# EAGLE design MAIN (EAGLE 7.6.0)
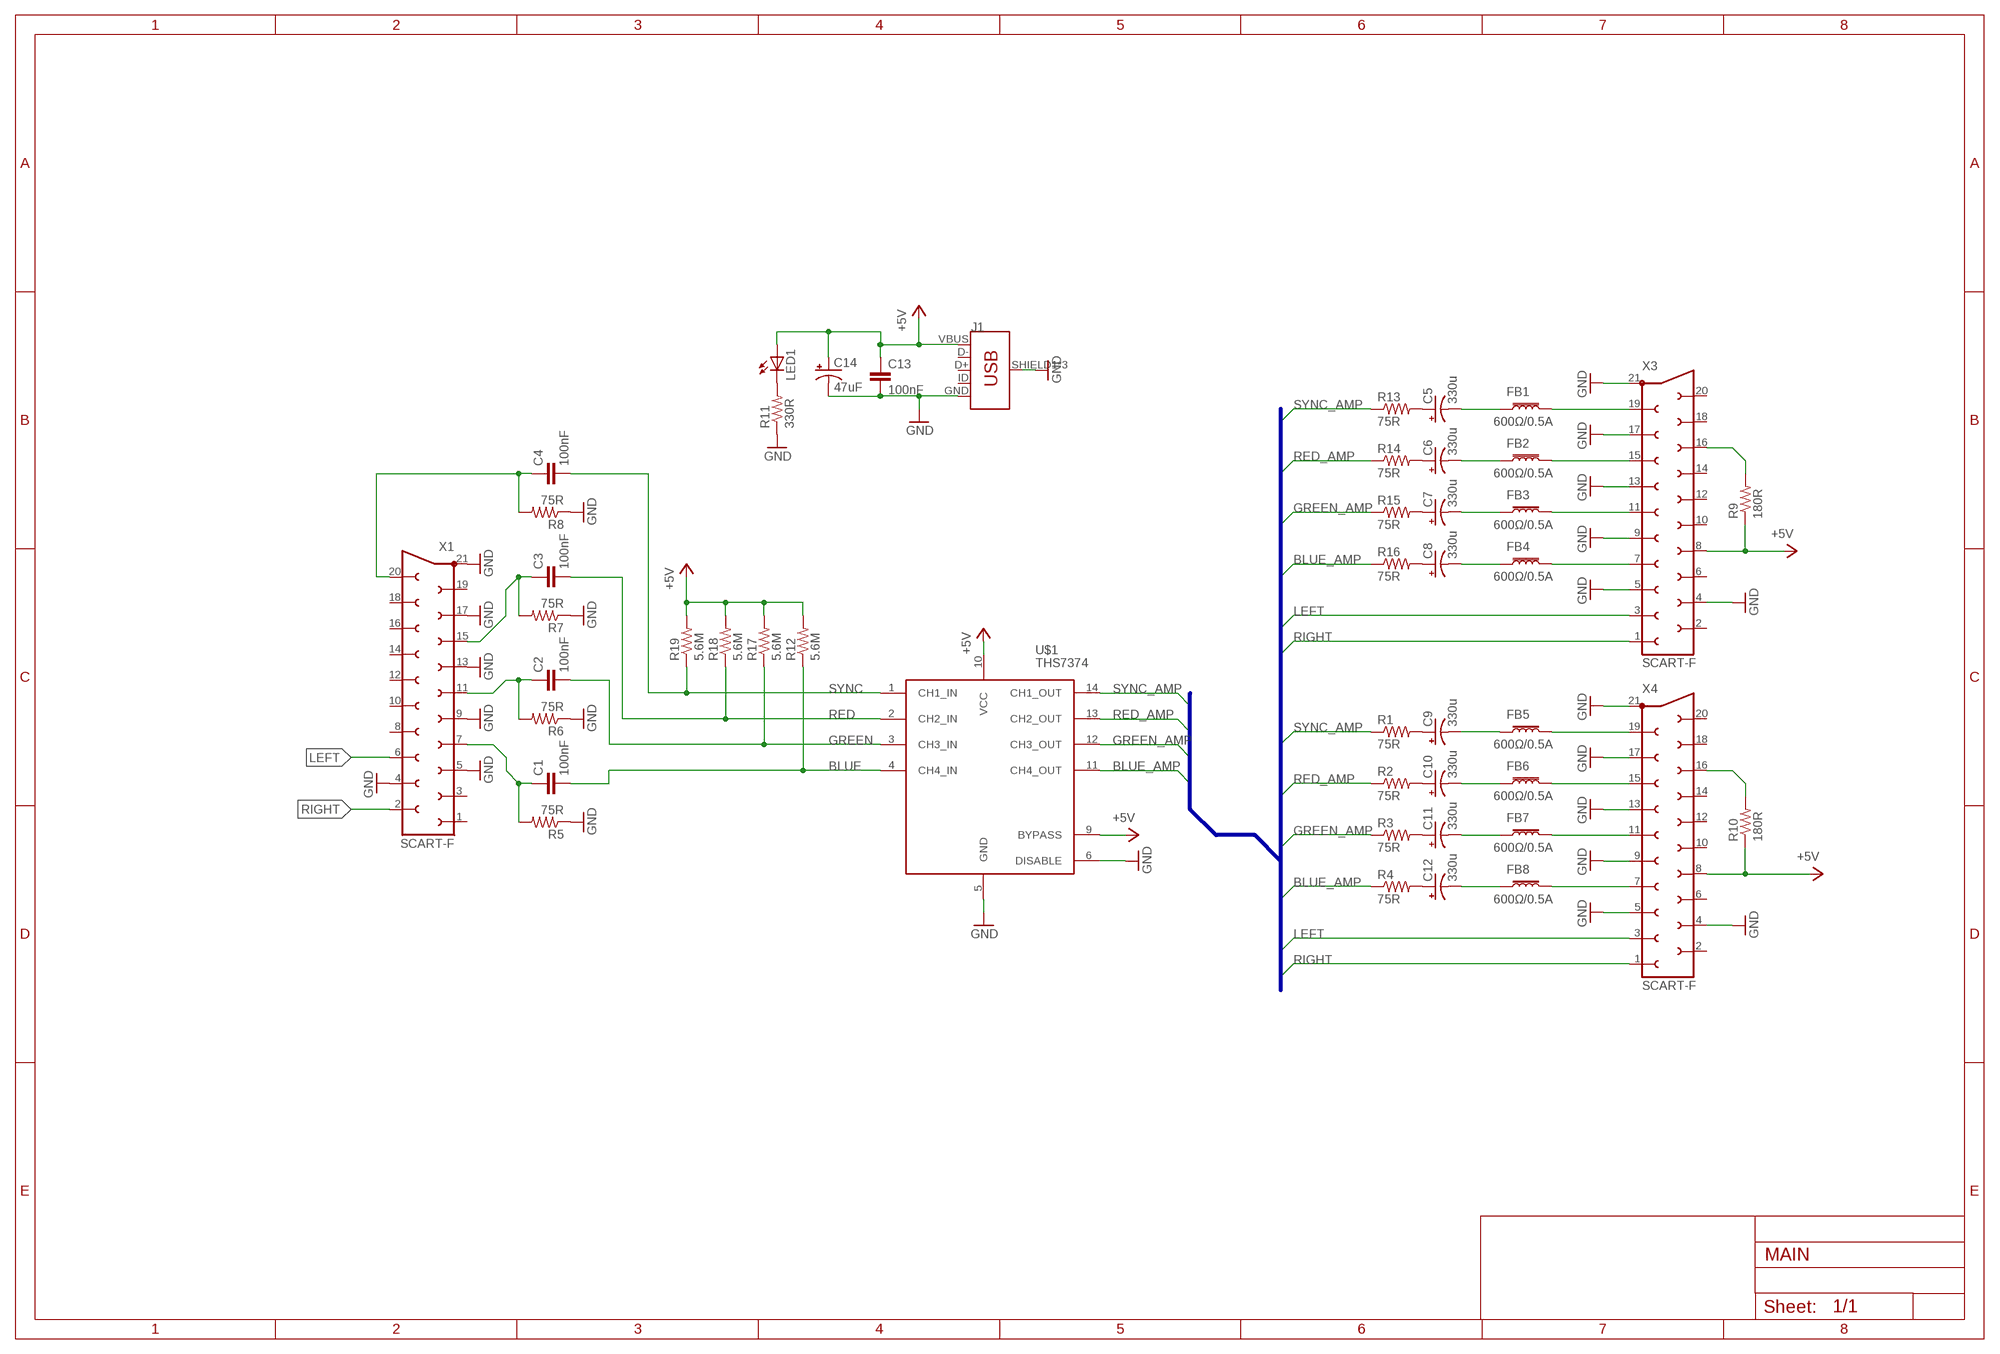
[diagram p0: schematic, sheet 1]

## Parts
C1  100nF  C-EU050-025X075  [C050-025X075]
C2  100nF  C-EU050-025X075  [C050-025X075]
C3  100nF  C-EU050-025X075  [C050-025X075]
C4  100nF  C-EU050-025X075  [C050-025X075]
C5  330u  CPOL-USE3.5-8  [E3,5-8]
C6  330u  CPOL-USE3.5-8  [E3,5-8]
C7  330u  CPOL-USE3.5-8  [E3,5-8]
C8  330u  CPOL-USE3.5-8  [E3,5-8]
C9  330u  CPOL-USE3.5-8  [E3,5-8]
C10  330u  CPOL-USE3.5-8  [E3,5-8]
C11  330u  CPOL-USE3.5-8  [E3,5-8]
C12  330u  CPOL-USE3.5-8  [E3,5-8]
C13  100nF  C-EU050-025X075  [C050-025X075]
C14  47uF  CPOL-USE3.5-8  [E3,5-8]
FB1  600Ω/0.5A  FERRITE_BEAD-0603  [0603]
FB2  600Ω/0.5A  FERRITE_BEAD-0603  [0603]
FB3  600Ω/0.5A  FERRITE_BEAD-0603  [0603]
FB4  600Ω/0.5A  FERRITE_BEAD-0603  [0603]
FB5  600Ω/0.5A  FERRITE_BEAD-0603  [0603]
FB6  600Ω/0.5A  FERRITE_BEAD-0603  [0603]
FB7  600Ω/0.5A  FERRITE_BEAD-0603  [0603]
FB8  600Ω/0.5A  FERRITE_BEAD-0603  [0603]
J1  USB_MICRO-B_FEMALE-SMT  [USB-B-MICRO-SMD]
LED1  LED5MM  [LED5MM]
R1  75R  R-US_0204/7  [0204/7]
R2  75R  R-US_0204/7  [0204/7]
R3  75R  R-US_0204/7  [0204/7]
R4  75R  R-US_0204/7  [0204/7]
R5  75R  R-US_0204/7  [0204/7]
R6  75R  R-US_0204/7  [0204/7]
R7  75R  R-US_0204/7  [0204/7]
R8  75R  R-US_0204/7  [0204/7]
R9  180R  R-US_0204/7  [0204/7]
R10  180R  R-US_0204/7  [0204/7]
R11  330R  R-US_0204/7  [0204/7]
R12  5.6M  R-US_0204/7  [0204/7]
R13  75R  R-US_0204/7  [0204/7]
R14  75R  R-US_0204/7  [0204/7]
R15  75R  R-US_0204/7  [0204/7]
R16  75R  R-US_0204/7  [0204/7]
R17  5.6M  R-US_0204/7  [0204/7]
R18  5.6M  R-US_0204/7  [0204/7]
R19  5.6M  R-US_0204/7  [0204/7]
U$1  THS7374  [TSSOP-14]
X1  SCART-F  [SCART-F]
X3  SCART-F  [SCART-F]
X4  SCART-F  [SCART-F]

## Nets
+5V: C13.1 C14.+ J1.VBUS LED1.A R9.1 R10.1 R12.2 R17.2 R18.2 R19.2 U$1.9(BYPASS) U$1.10(VCC) X3.8 X4.8
BLUE: C1.2 R12.1 U$1.4(CH4_IN)
BLUE_AMP: R4.1 R16.1 U$1.11(CH4_OUT)
GND: C13.2 C14.- J1.GND J1.SHIELD1(SHIELD) J1.SHIELD2(SHIELD) J1.SHIELD3(SHIELD) R5.1 R6.1 R7.1 R8.1 R11.1 U$1.5(GND) U$1.6(DISABLE) X1.4 X1.5 X1.9 X1.13 X1.17 X1.21 X3.4 X3.5 X3.9 X3.13 X3.17 X3.21 X4.4 X4.5 X4.9 X4.13 X4.17 X4.21
GREEN: C2.2 R17.1 U$1.3(CH3_IN)
GREEN_AMP: R3.1 R15.1 U$1.12(CH3_OUT)
LEFT: X1.6 X3.3 X4.3
N$1: C9.+ R1.2
N$2: C10.+ R2.2
N$3: C11.+ R3.2
N$4: C12.+ R4.2
N$5: C5.+ R13.2
N$6: C6.+ R14.2
N$7: C7.+ R15.2
N$8: C8.+ R16.2
N$9: R10.2 X4.16
N$10: C1.1 R5.2 X1.7
N$11: R9.2 X3.16
N$12: C2.1 R6.2 X1.11
N$13: C3.1 R7.2 X1.15
N$16: LED1.K(C) R11.2
N$19: C4.1 R8.2 X1.20
N$21: C5.- FB1.1
N$22: C6.- FB2.1
N$23: C7.- FB3.1
N$24: C8.- FB4.1
N$25: FB1.2 X3.19
N$26: FB2.2 X3.15
N$27: FB3.2 X3.11
N$28: FB4.2 X3.7
N$29: FB8.2 X4.7
N$30: FB7.2 X4.11
N$31: FB6.2 X4.15
N$32: FB5.2 X4.19
N$33: C9.- FB5.1
N$34: C10.- FB6.1
N$35: C11.- FB7.1
N$36: C12.- FB8.1
RED: C3.2 R18.1 U$1.2(CH2_IN)
RED_AMP: R2.1 R14.1 U$1.13(CH2_OUT)
RIGHT: X1.2 X3.1 X4.1
SYNC: C4.2 R19.1 U$1.1(CH1_IN)
SYNC_AMP: R1.1 R13.1 U$1.14(CH1_OUT)
Unconnected: J1.D+ J1.D- J1.ID X1.1 X1.3 X1.8 X1.10 X1.12 X1.14 X1.16 X1.18 X1.19 X3.2 X3.6 X3.10 X3.12 X3.14 X3.18 X3.20 X4.2 X4.6 X4.10 X4.12 X4.14 X4.18 X4.20

## Buses
B$1

## Library data of the parts
C1-C4 C13 = rcl:C-EU: CAPACITOR, European symbol
C5-C12 C14 = rcl:CPOL-US: POLARIZED CAPACITOR, American symbol
FB1-FB8 = SparkFun-Coils:FERRITE_BEAD: Ferrite Bead (blocks, cores, rings, chokes, etc.) Inductor with layers of ferrite used to suppress high frequencies. Often used to isolate high frequency noise. SparkFun Products: IOIO-OTG - V2.2 <https://www.sparkfun.com/products/13613> SparkFun SAMD21 Mini Breakout <https://www.sparkfun.com/products/13664> SparkFun 6 Degrees of Freedom Breakout - LSM6DS3 <https://www.sparkfun.com/products/13339> SparkFun SAMD21 Dev Breakout <https://www.sparkfun.com/products/13672>; PROD_ID: NDUC-13805; VALUE: 30Ω/1.8A
J1 = SparkFun-Connectors:USB_MICRO-B: USB Type Micro-B Connector Male/female and PTH/SMT variants SparkFun Products: SparkFun microB USB Breakout <https://www.sparkfun.com/products/12035> SparkFun USB microB Plug Breakout <https://www.sparkfun.com/products/10031> SparkFun ESP8266 Thing <https://www.sparkfun.com/products/13231>; PROD_ID: CONN-11752
LED1 = led:LED: LED OSRAM: - CHIPLED LG R971, LG N971, LY N971, LG Q971, LY Q971, LO R971, LY R971 LH N974, LH R974 LS Q976, LO Q976, LY Q976 LO Q996 - Hyper CHIPLED LW Q18S LB Q993, LB Q99A, LB R99A - SideLED LS A670, LO A670, LY A670, LG A670, LP A670 LB A673, LV A673, LT A673, LW A673 LH A674 LY A675 LS A676, LA A676, LO A676, LY A676, LW A676 LS A679, LY A679, LG A679 - Hyper Micro SIDELED® LS Y876, LA Y876, LO Y876, LY Y876 LT Y87S - SmartLED LW L88C, LW L88S LB L89C, LB L89S, LG L890 LS L89K, LO L89K, LY L89K LS L896, LA L896, LO L896, LY L896 - TOPLED LS T670, LO T670, LY T670, LG T670, LP T670 LSG T670, LSP T670, LSY T670, LOP T670, LYG T670 LG T671, LOG T671, LSG T671 LB T673, LV T673, LT T673, LW T673 LH T674 LS T676, LA T676, LO T676, LY T676, LB T676, LH T676, LSB T676, LW T676 LB T67C, LV T67C, LT T67C, LS T67K, LO T67K, LY T67K, LW E67C LS E67B, LA E67B, LO E67B, LY E67B, LB E67C, LV E67C, LT E67C LW T67C LS T679, LY T679, LG T679 LS T770, LO T770, LY T770, LG T770, LP T770 LB T773, LV T773, LT T773, LW T773 LH T774 LS E675, LA E675, LY E675, LS T675 LS T776, LA T776, LO T776, LY T776, LB T776 LHGB T686 LT T68C, LB T68C - Hyper Mini TOPLED® LB M676 - Mini TOPLED Santana® LG M470 LS M47K, LO M47K, LY M47K Source: http://www.osram.convergy.de LUXEON: - LUMILED® LXK2-PW12-R00, LXK2-PW12-S00, LXK2-PW14-U00, LXK2-PW14-V00 LXK2-PM12-R00, LXK2-PM12-S00, LXK2-PM14-U00 LXK2-PE12-Q00, LXK2-PE12-R00, LXK2-PE12-S00, LXK2-PE14-T00, LXK2-PE14-U00 LXK2-PB12-K00, LXK2-PB12-L00, LXK2-PB12-M00, LXK2-PB14-N00, LXK2-PB14-P00, LXK2-PB14-Q00 LXK2-PR12-L00, LXK2-PR12-M00, LXK2-PR14-Q00, LXK2-PR14-R00 LXK2-PD12-Q00, LXK2-PD12-R00, LXK2-PD12-S00 LXK2-PH12-R00, LXK2-PH12-S00 LXK2-PL12-P00, LXK2-PL12-Q00, LXK2-PL12-R00 Source: www.luxeon.com KINGBRIGHT: KA-3528ASYC Source: www.kingbright.com
R1-R19 = rcl:R-US_: RESISTOR, American symbol
U$1 = THS7374:THS7374
X1 X3 X4 = con-hirschmann:SCART-F: TV SCART CONNECTOR; OC_FARNELL: unknown; OC_NEWARK: unknown

## Net classes
0 default: width 0.406 mm

## Board
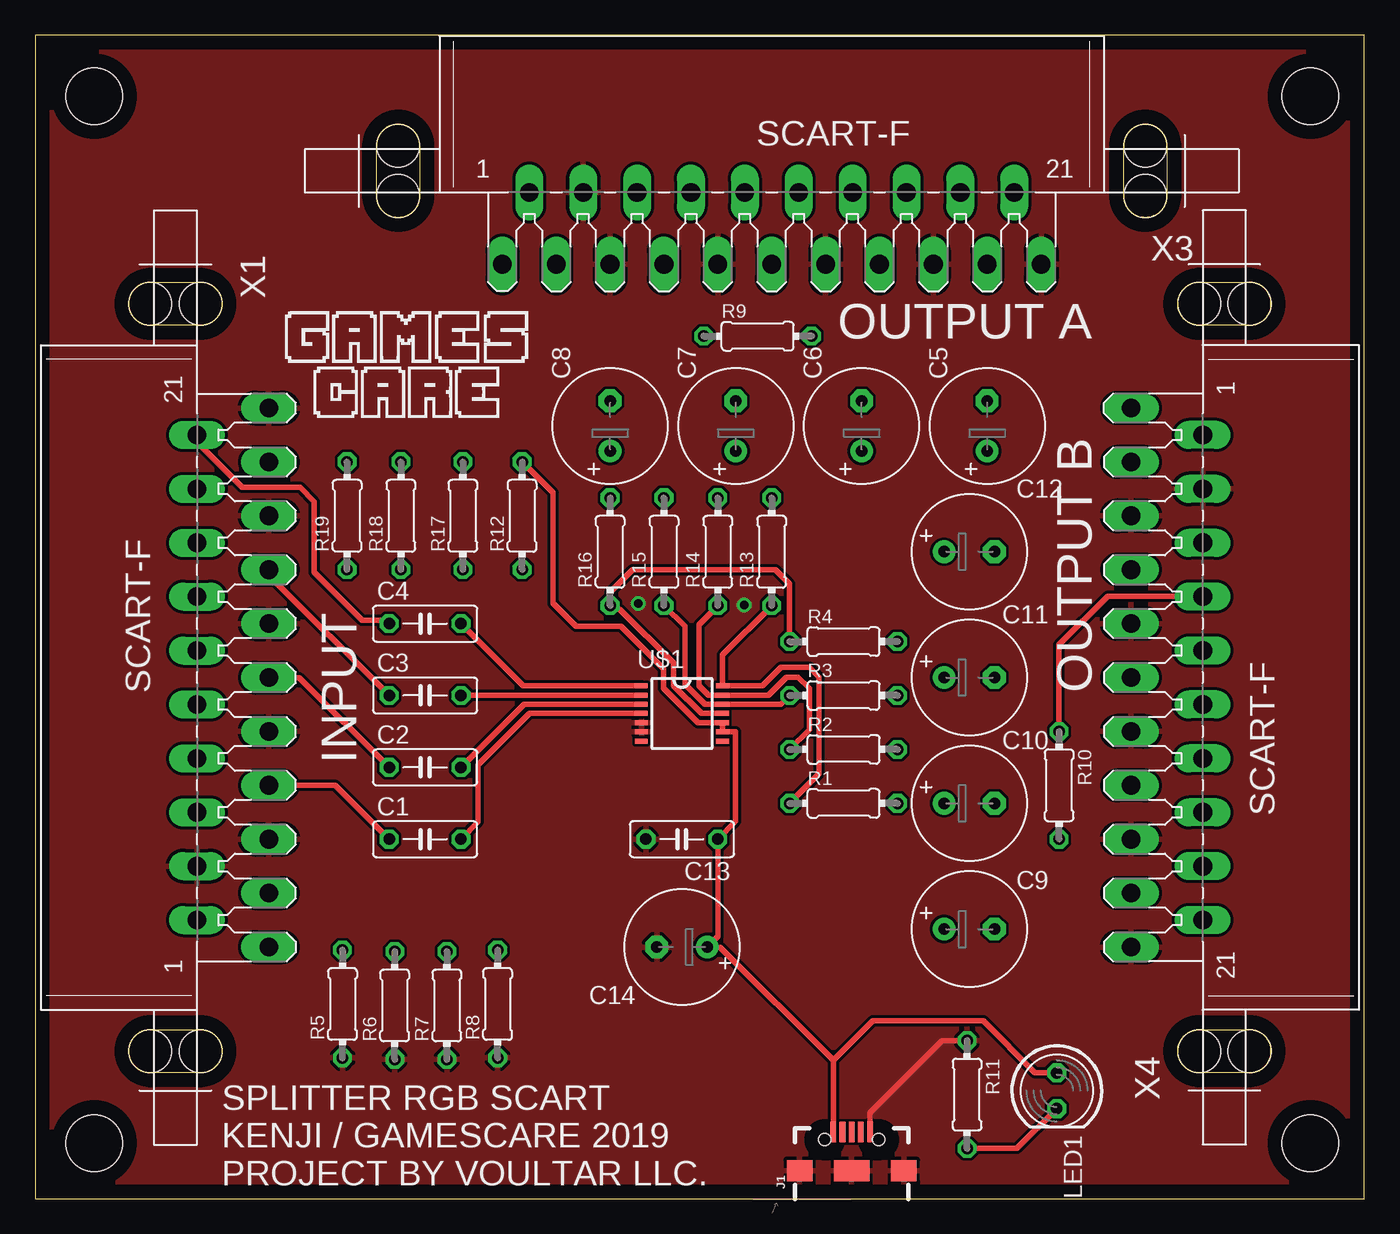
[diagram p1: board, top side]
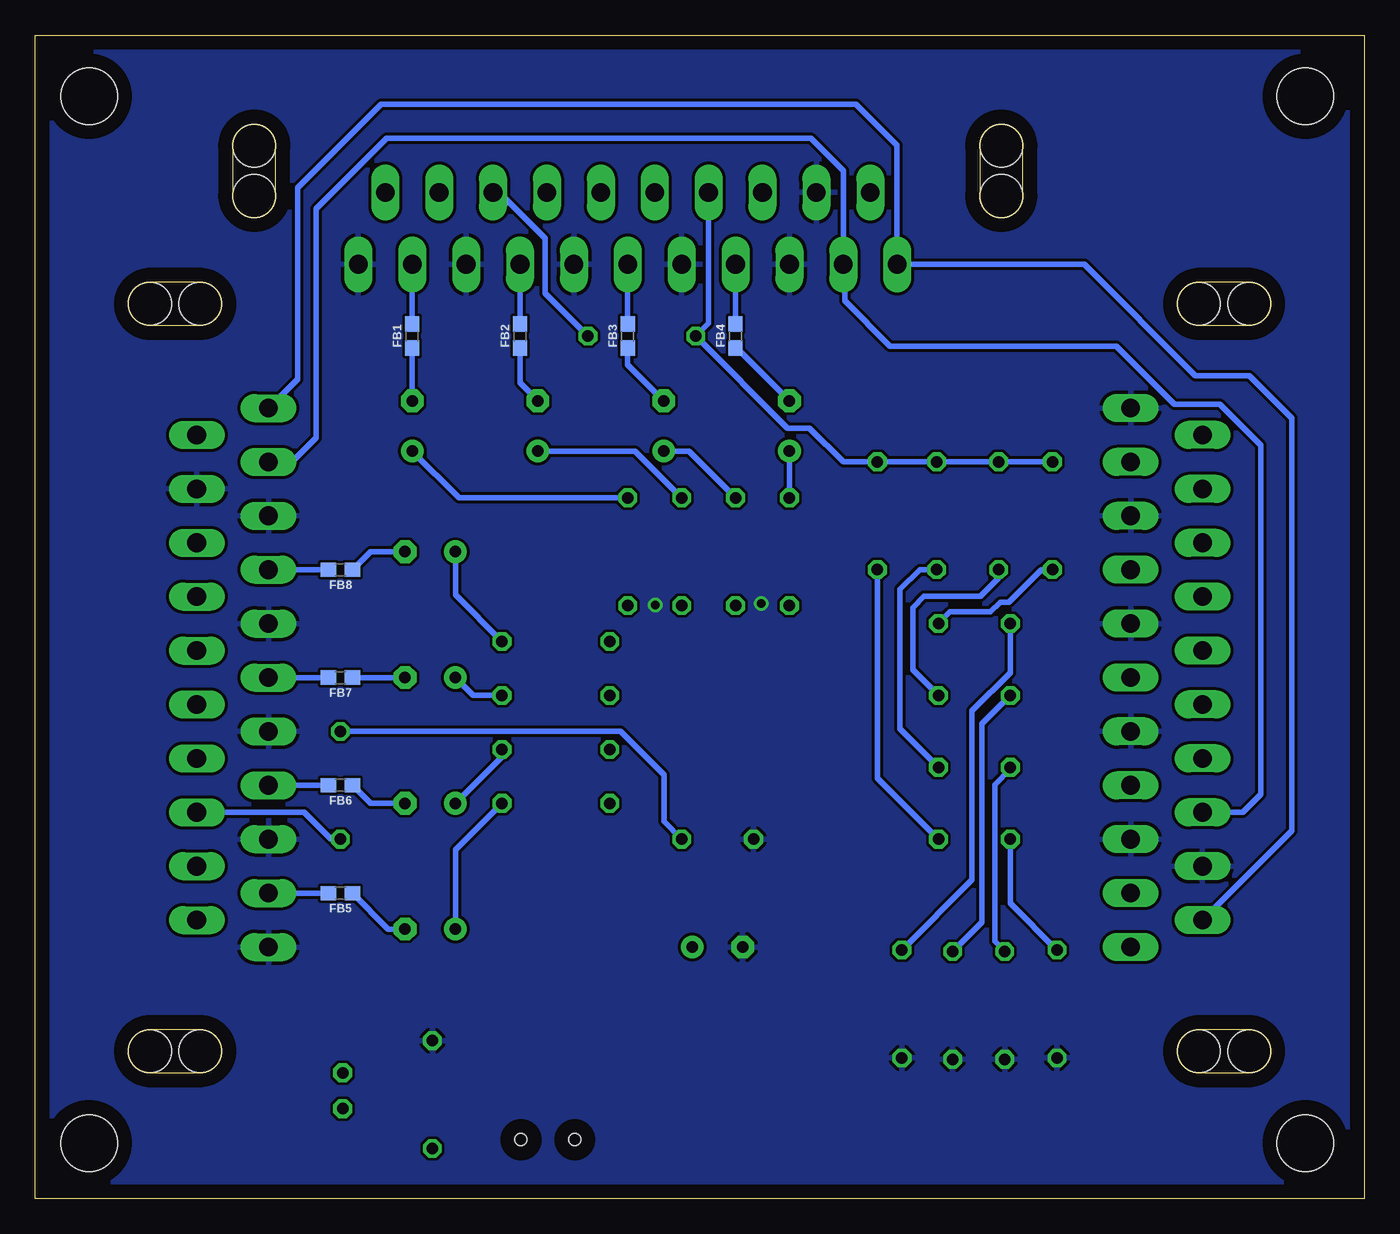
[diagram p2: board, bottom side, seen from below]

Size 93.96 x 82.22 mm. Coordinates in mm from the lower left corner, seen from the top.
Outline: 0,0 93.96,0 93.96,82.22 0,82.22 0,0
Copper layers (1*16): Top 0.035mm / dielectric 1.5mm / Bottom 0.035mm
Design rules "default": minimum track width 10mil, minimum drill 24mil, track to track 8mil, track to pad 8mil, pad to pad 8mil, via to via 8mil, smd to smd 8mil, copper to edge 40mil, drill to drill 8mil, minimum pad ring 10mil, minimum via ring 8mil, stop-mask expansion 4mil, vias tented up to drill 0mil, thermal gap 10mil
Holes 4 mm at 4.16,77.92 90.16,77.92 90.16,3.92 4.16,3.92

### Footprints (pad centres in the part's own frame; a part is rotated, then mirrored left to right if it is on the bottom)
C050-025X075 = drill 0.813 octagon: 1 -2.54,0; 2 2.54,0
E3,5-8 = drill 0.813 pad 1.6: + -1.778,0 | drill 0.813 pad 1.6 octagon: - 1.778,0
0603 = smd 1.1 x 1: 1 -0.85,0; 2 0.85,0
USB-B-MICRO-SMD = smd 1.45 x 0.4: D+ 2.725,0; D- 2.725,0.65; GND 2.725,-1.3; ID 2.725,-0.65; VBUS 2.725,1.3 | smd 1.5 x 1.8: SHIELD1 0,3.685; SHIELD2 0,-3.685 | smd 1.5 x 2.5: SHIELD3 0,0 | hole 0.85: 2.2,1.9; 2.2,-1.9
LED5MM = drill 0.813 octagon: A -1.27,0; K 1.27,0
0204/7 = drill 0.813 octagon: 1 -3.81,0; 2 3.81,0
TSSOP-14 = smd 0.9 x 0.35: 1 -2.875,1.95; 2 -2.875,1.3; 3 -2.875,0.65; 4 -2.875,0; 5 -2.875,-0.65; 6 -2.875,-1.3; 7 -2.875,-1.95; 8 2.875,-1.95; 9 2.875,-1.3; 10 2.875,-0.65; 11 2.875,0; 12 2.875,0.65; 13 2.875,1.3; 14 2.875,1.95
SCART-F = drill 1.321 long: 1 19.05,5.08; 2 17.145,0; 3 15.24,5.08; 4 13.335,0; 5 11.43,5.08; 6 9.525,0; 7 7.62,5.08; 8 5.715,0; 9 3.81,5.08; 10 1.905,0; 11 0,5.08; 12 -1.905,0; 13 -3.81,5.08; 14 -5.715,0; 15 -7.62,5.08; 16 -9.525,0; 17 -11.43,5.08; 18 -13.335,0; 19 -15.24,5.08; 20 -17.145,0; 21 -19.05,5.08 | hole 3.023: 26.416,0.254; 26.416,-3.302; -26.416,0.254; -26.416,-3.302

### Placement (x,y rotation side)
C1  27.56,25.4 0 top
C2  27.56,30.48 0 top
C3  27.56,35.56 0 top
C4  27.56,40.64 0 top
C5  67.31,54.61 90 top
C6  58.42,54.61 90 top
C7  49.53,54.61 90 top
C8  40.64,54.61 90 top
C9  66.04,19.05 0 top
C10  66.04,27.94 0 top
C11  66.04,36.83 0 top
C12  66.04,45.72 0 top
C13  45.72,25.4 180 top
C14  45.72,17.78 180 top
FB1  67.31,60.96 90 bottom
FB2  59.69,60.96 90 bottom
FB3  52.07,60.96 90 bottom
FB4  44.45,60.96 90 bottom
FB5  72.39,21.59 180 bottom
FB6  72.39,29.21 180 bottom
FB7  72.39,36.83 180 bottom
FB8  72.39,44.45 180 bottom
J1  57.72,1.96 90 top
LED1  72.23,7.62 270 top
R1  57.15,27.94 0 top
R2  57.15,31.75 0 top
R3  57.15,35.56 0 top
R4  57.15,39.37 0 top
R5  21.72,13.75 90 top
R6  25.41,13.65 90 top
R7  29.1,13.65 90 top
R8  32.69,13.75 90 top
R9  51.07,60.96 0 top
R10  72.39,29.21 270 top
R11  65.88,7.35 270 top
R12  34.42,48.27 90 top
R13  52.07,45.72 90 top
R14  48.26,45.72 90 top
R15  44.45,45.72 90 top
R16  40.64,45.72 90 top
R17  30.23,48.27 90 top
R18  25.85,48.27 90 top
R19  22.04,48.27 90 top
U$1  45.72,34.29 0 top
X1  11.43,36.83 270 top
X3  52.07,71.12 180 top
X4  82.55,36.83 90 top

### Tracks (layer width: path | path; a pad name or v marks a point on that pad's centre or on a via)
+5V
  Top 0.406: 56.42,9.76 48.4,17.78 C14.+ 48.26,18.54 C13.1 49.52,26.66 49.52,32.99 U$1.9 U$1.10 46.84,33.64 44.42,36.06 44.42,37.46 41.42,40.46 38.22,40.46 36.62,42.06 36.62,49.88 R12.2 | LED1.A 70.69,8.89 67.02,12.56 59.22,12.56 56.42,9.76 | R10.1 72.39,39.13 75.82,42.56 82.53,42.56 X4.8 | 56.42,9.76 J1.VBUS
  Bottom 0.406: X3.8 46.35,61.86 R9.1 40.76,54.46 39.22,54.46 36.83,52.07 R12.2 R17.2 R18.2 R19.2 | R10.1 52.58,33.02 49.52,29.96 49.52,26.66 C13.1
BLUE
  Top 0.406: U$1.4 34.95,34.29 31.32,30.66 31.32,26.62 C1.2
  Bottom 0.406: R12.1 34.42,29.72 C1.2
BLUE_AMP
  Top 0.406: U$1.11 47.09,34.29 45.12,36.26 45.12,37.86 41.32,41.66 40.89,41.66 R16.1 | 40.69,41.96 R16.1 | R4.1 53.34,43.44 52.32,44.46 42.22,44.46 40.62,42.86 40.62,41.93 R16.1
GND  (via drill 0.61)
  Top 0.406: J1.GND 59.02,6.06 64.12,11.16 R11.1
  other vias: 42.62,42.06 50.12,41.96
  pour Bottom: -0.28,-0.24 -0.28,82.76 93.72,82.76 93.72,-0.24
  pour Top: -0.28,82.76 93.72,82.76 93.72,-0.24 -0.28,-0.24
GREEN
  Top 0.406: U$1.3 34.56,34.94 C2.2
  Bottom 0.406: R17.1 31.43,44.46 32.82,43.06 32.82,33.2 C2.2
GREEN_AMP
  Top 0.406: R15.1 45.92,40.44 45.92,36.36 47.34,34.94 U$1.12 52.72,34.94 R3.1
LEFT
  Bottom 0.406: X1.6 8.58,27.31 7.32,28.56 7.32,53.26 10.22,56.16 13.42,56.16 17.52,60.26 33.52,60.26 36.72,63.46 36.72,65.93 X3.3 36.82,72.66 39.12,74.96 69.12,74.96 74.12,69.96 74.12,53.76 75.81,52.07 X4.3
N$1
  Bottom 0.406: C9.+ 64.26,24.64 R1.2
N$2
  Bottom 0.406: R2.2 60.96,31.24 C10.+
N$3
  Bottom 0.406: R3.2 62.99,35.56 C11.+
N$4
  Bottom 0.406: C12.+ 64.26,42.67 R4.2
N$5
  Bottom 0.406: R13.2 64.01,49.53 C5.+
N$6
  Bottom 0.406: C6.+ 51.56,52.83 R14.2
N$7
  Bottom 0.406: C7.+ 47.75,52.83 R15.2
N$8
  Bottom 0.406: C8.+ R16.2
N$9
  Bottom 0.406: R10.2 73.06,25.4 74.96,27.31 X4.16
N$10
  Top 0.406: X1.7 21.21,29.21 C1.1
  Bottom 0.406: C1.1 25.02,20.86 R5.2
N$11
  Bottom 0.406: X3.16 61.18,71.12 57.92,67.86 57.92,64 R9.2
N$12
  Top 0.406: X1.11 18.67,36.83 C2.1
  Bottom 0.406: C2.1 25.02,30.36 26.12,29.26 26.12,18.17 R6.2
N$13
  Top 0.406: X1.15 16.51,44.07 C3.1
  Bottom 0.406: C3.1 27.02,33.56 27.02,19.54 R7.2
N$16
  Top 0.406: R11.2 69.42,3.54 LED1.K
N$19
  Top 0.406: X1.20 11.43,53.45 14.62,50.26 18.72,50.26 19.72,49.26 19.72,44.26 23.12,40.86 24.8,40.86 C4.1
  Bottom 0.406: C4.1 25.02,37.16 27.72,34.46 27.72,22.53 R8.2
N$21
  Bottom 0.406: FB1.1 C5.-
N$22
  Bottom 0.406: FB2.1 59.69,57.66 C6.-
N$23
  Bottom 0.406: FB3.1 52.07,58.93 C7.-
N$24
  Bottom 0.406: FB4.1 44.36,60.11 C8.-
N$25
  Bottom 0.406: X3.19 FB1.2
N$26
  Bottom 0.406: X3.15 FB2.2
N$27
  Bottom 0.406: X3.11 FB3.2
N$28
  Bottom 0.406: X3.7 FB4.2
N$29
  Bottom 0.406: FB8.2 X4.7
N$30
  Bottom 0.406: X4.11 FB7.2
N$31
  Bottom 0.406: FB6.2 X4.15
N$32
  Bottom 0.406: FB5.2 X4.19
N$33
  Bottom 0.406: C9.- 69,19.05 FB5.1
N$34
  Bottom 0.406: C10.- 70.27,27.94 FB6.1
N$35
  Bottom 0.406: FB7.1 C11.-
N$36
  Bottom 0.406: C12.- 70.27,45.72 FB8.1
RED
  Top 0.406: U$1.2 30.13,35.59 C3.2
  Bottom 0.406: R18.1 25.85,43.83 27.12,42.56 31.12,42.56 31.92,41.76 31.92,37.38 C3.2
RED_AMP
  Top 0.406: R14.1 46.92,40.57 46.92,36.26 47.59,35.59 U$1.13 51.85,35.59 53.12,36.86 53.92,36.86 54.72,36.06 54.72,33.13 R2.1
RIGHT
  Bottom 0.406: X1.2 5.12,25.99 5.12,55.16 8.12,58.16 11.92,58.16 19.8,66.04 X3.1 33.02,74.46 35.92,77.36 69.52,77.36 75.42,71.46 75.42,57.93 X4.1
SYNC
  Top 0.406: U$1.1 34.5,36.24 C4.2
  Bottom 0.406: R19.1 22.83,44.46 25.12,42.16 25.72,42.16 26.42,41.46 29.28,41.46 C4.2
SYNC_AMP
  Top 0.406: R13.1 48.59,38.43 U$1.14 51.4,36.24 52.72,37.56 54.72,37.56 55.42,36.86 55.42,30.02 R1.1

### Text on the board
tPlace: OUTPUT A | OUTPUT B | INPUT | SPLITTER RGB SCART / KENJI / GAMESCARE 2019 / PROJECT BY VOULTAR LLC.